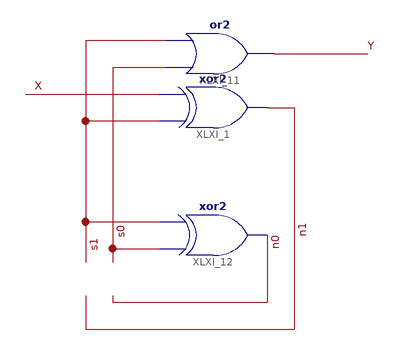
[diagram p0: schematic sheet 1]
// Xilinx ISE schematic quiz5.sch (artix7) as structural Verilog: 3 symbols, 0 ports
module quiz5 (
);

  wire n0, n1, s0, s1, X, Y;

  xor XLXI_1 (n1, s1, X);
  or XLXI_11 (Y, s0, s1);
  xor XLXI_12 (n0, s0, s1);
endmodule
